# Altium schematic sheet [02] Power.SchDoc
size B; Organization: Altium Limited; Address1: L3, 12a Rodborough Rd; Address2: Frenchs Forest; Address3: NSW; Address4: Australia 2086
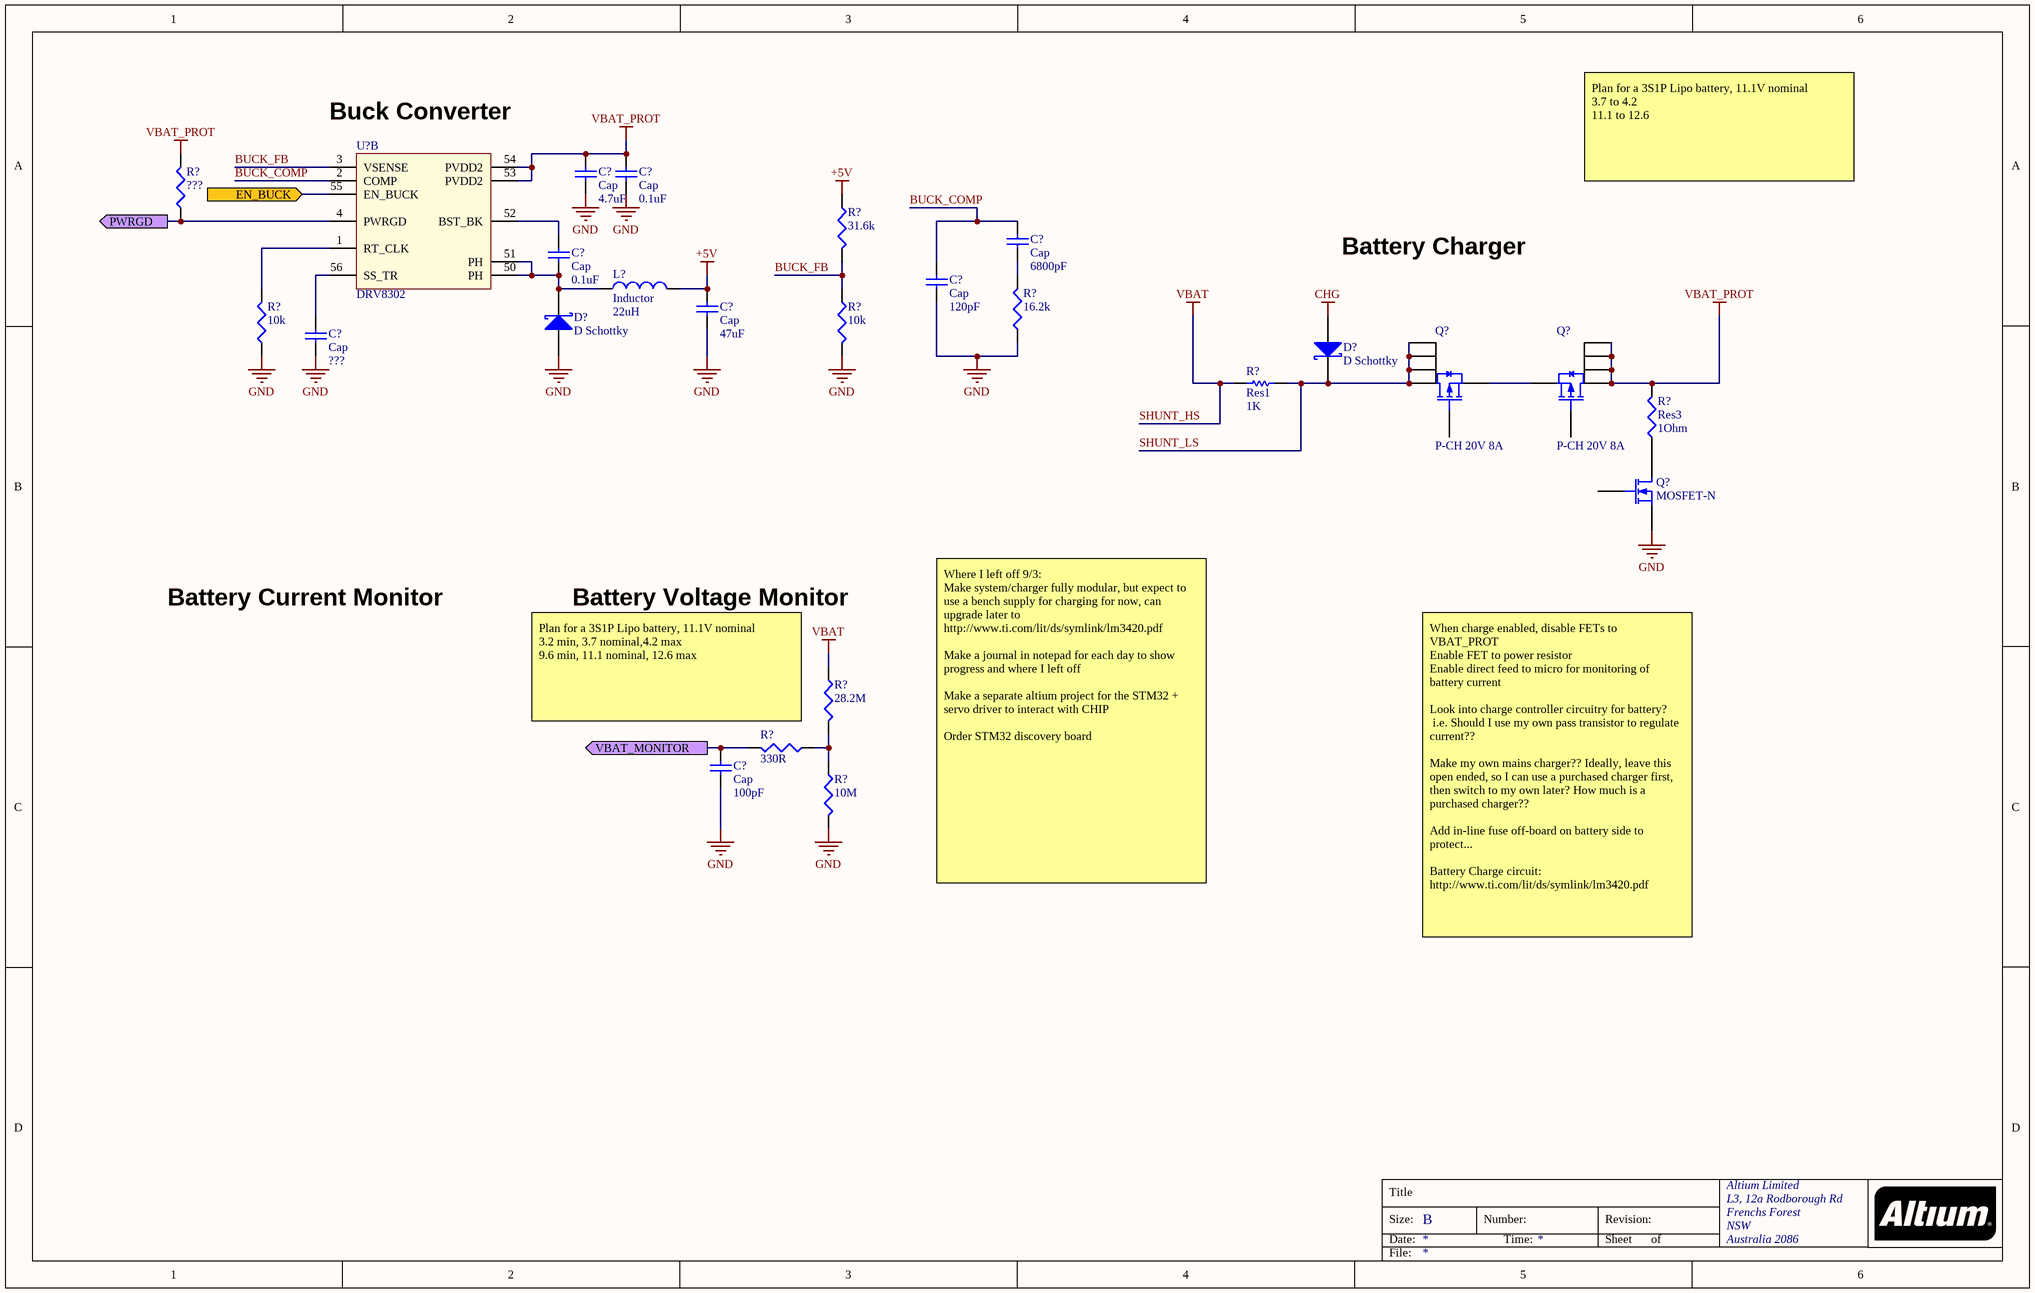
[diagram p0: [02] Power.SchDoc]

## Parts
(Parts that share a designator on the sheet are numbered #1, #2 ... from top to bottom, then left to right.)
C?#1  Cap  value 4.7uF  [RAD-0.3]
C?#2  Cap  value 0.1uF  [RAD-0.3]
C?#3  Cap  value 6800pF  [RAD-0.3]
C?#4  Cap  value 0.1uF  [RAD-0.3]
C?#5  Cap  value 120pF  [RAD-0.3]
C?#6  Cap  value 47uF  [RAD-0.3]
C?#7  Cap  value ???  [RAD-0.3]
C?#8  Cap  value 100pF  [RAD-0.3]
D?#1  D Schottky  [SMB]
D?#2  D Schottky  [SMB]
L?  Inductor  value 22uH  [AXIAL-0.8]
Q?#1  P-CH 20V 8A  [TSOP-6]
Q?#2  P-CH 20V 8A  [TSOP-6]
Q?#3  MOSFET-N  [E3]
R?#1  ???  [0603_CAP]
R?#2  31.6k  [0603_CAP]
R?#3  16.2k  [0603_CAP]
R?#4  10k  [0603_CAP]
R?#5  10k  [0603_CAP]
R?#6  Res1  value 1K  [AXIAL-0.3]
R?#7  Res3  value 1Ohm  [J1-0603]
R?#8  28.2M  [0603_CAP]
R?#9  330R  [0603_CAP]
R?#10  10M  [0603_CAP]
U?  DRV8302  (part B of 2)

## Ports
EN_BUCK (in), PWRGD (out), VBAT_MONITOR (out)

## Nets
+5V: C?#6.2 L?.2 R?#2.2
CHG: D?#2.1(A)
GND: C?#1.1 C?#2.1 C?#5.1 C?#6.1 C?#7.1 C?#8.1 D?#1.1(A) Q?#3.3(S) R?#3.1 R?#4.1 R?#5.1 R?#10.1
SHUNT_HS: R?#6.1 R?#8.2  [also labelled VBAT]
VBAT_PROT: C?#1.2 C?#2.2 Q?#2.1(D) Q?#2.2(D) Q?#2.5(D) Q?#2.6(D) R?#1.2 R?#7.2 U?.53(PVDD2) U?.54(PVDD2)
BUCK_COMP: C?#3.2 C?#5.2 U?.2(COMP)
BUCK_FB: R?#2.1 R?#5.2 U?.3(VSENSE)
EN_BUCK: U?.55(EN_BUCK) ; port EN_BUCK
PWRGD: R?#1.1 U?.4(PWRGD) ; port PWRGD
SHUNT_LS: D?#2.2(K) Q?#1.1(D) Q?#1.2(D) Q?#1.5(D) Q?#1.6(D) R?#6.2
VBAT_MONITOR: C?#8.2 R?#9.1 ; port VBAT_MONITOR
NetC?#3_1: C?#3.1 R?#3.2
NetC?#4_1: C?#4.1 D?#1.2(K) L?.1 U?.50(PH) U?.51(PH)
NetC?#4_2: C?#4.2 U?.52(BST_BK)
NetC?#7_2: C?#7.2 U?.56(SS_TR)
NetQ?#1_4: Q?#1.4(S) Q?#2.4(S)
NetQ?#3_1: Q?#3.1(D) R?#7.1
NetR?#4_2: R?#4.2 U?.1(RT_CLK)
NetR?#8_1: R?#8.1 R?#9.2 R?#10.2

Not connected (* = marked no-connect by the designer): Q?#1 3(G); Q?#2 3(G); Q?#3 2(G)

## Notes on the sheet
- (near U?) Buck Converter
- Plan for a 3S1P Lipo battery, 11.1V nominal
  3.7 to 4.2
  11.1 to 12.6
- Battery Charger
- Battery Current Monitor
- Battery Voltage Monitor
- (near R?#8) Plan for a 3S1P Lipo battery, 11.1V nominal
  3.2 min, 3.7 nominal,4.2 max
  9.6 min, 11.1 nominal, 12.6 max
- Where I left off 9/3:
  Make system/charger fully modular, but expect to use a bench supply for charging for now, can upgrade later to
  http://www.ti.com/lit/ds/symlink/lm3420.pdf
  Make a journal in notepad for each day to show progress and where I left off
  Make a separate altium project for the STM32 + servo driver to interact with CHIP
  Order STM32 discovery board
- When charge enabled, disable FETs to VBAT_PROT
  Enable FET to power resistor
  Enable direct feed to micro for monitoring of battery current
  Look into charge controller circuitry for battery?
  i.e. Should I use my own pass transistor to regulate current??
  Make my own mains charger?? Ideally, leave this open ended, so I can use a purchased charger first, then switch to my own later? How much is a purchased charger??
  Add in-line fuse off-board on battery side to protect...
  Battery Charge circuit:
  http://www.ti.com/lit/ds/symlink/lm3420.pdf
- Title
- Size:
- Date:
- B
- Number:
- Time:
- Revision:
- Sheet
- of
- File:

## Library data of the parts
C?#1-C?#8 = Cap: Capacitor; Published: 8-Jun-2000; LatestRevisionDate: 17-Jul-2002; LatestRevisionNote: Re-released for DXP Platform.; PackageReference: RAD-0.3; Publisher: Altium Limited; PackageDescription: Radial Cap, Thru-Hole; 2 Leads; 0.3 in Pin Spacing
D?#1 D?#2 = D Schottky: Schottky Diode; Published: 8-Jun-2000; LatestRevisionDate: 17-Jul-2002; LatestRevisionNote: Re-released for DXP Platform.; PackageReference: SMB; Publisher: Altium Limited; PackageDescription: DO-214-AA/SMB; 2 C-Bend Leads; Body 5.3 x 3.6 mm, inc. leads (LxW); Code_JEDEC: DO-214-AA
L? = Inductor: Code_IEC: 1005; Published: 8-Jun-2000; LatestRevisionDate: 29-May-2009; LatestRevisionNote: IPC-7351 Footprint Added.; PackageReference: 0402-A; Publisher: Altium Limited; PackageDescription: Chip Inductor; Code_JEITA: 0402
Q?#1 Q?#2 = SI3407DV-T1-GE3: MOSFET P-CH 20V 8A 6-TSOP; Manufacturer 1: Vishay Siliconix; Category 1: Discrete Semiconductor Products; FET Type: MOSFET P-Channel, Metal Oxide; FET Feature: Standard; Current - Continuous Drain (Id) @ 25°C: 8A (Tc); Rds On (Max) @ Id, Vgs: 24 mOhm @ 7.5A, 4.5V; Vgs(th) (Max) @ Id: 1.5V @ 250µA; Gate Charge (Qg) @ Vgs: 63nC @ 10V; Input Capacitance (Ciss) @ Vds: 1670pF @ 10V; Power - Max: 4.2W; Supplier 1: Digi-Key; Manufacturer Part Number 1: SI3407DV-T1-GE3; RoHS: RoHS Compliant; Description 1: MOSFET P-CH 20V 8A 6-TSOP; Stock 1: 6059; Pricing 1: 1=0.5, 10=0.425, 25=0.3964, 100=0.3172, 250=0.2946, 500=0.24926, 1000=0.19261 (USD); Packaging: Cut Tape (CT); Part Status: Active; Drain to Source Voltage (Vdss): 20V; Operating Temperature: -55°C ~ 150°C (TJ); Mounting Type: Surface Mount; Package / Case: SOT-23-6 Thin, TSOT-23-6; Supplier Device Package: 6-TSOP; ComponentLink1URL: http://www.vishay.com/docs/69987/si3407dv.pdf; ComponentLink1Description: http://www.vishay.com/docs/69987/si3407dv.pdf; Supplier Part Number 1: SI3407DV-T1-GE3CT-ND
Q?#3 = MOSFET-N: N-Channel MOSFET; Published: 8-Jun-2000; LatestRevisionDate: 17-Jul-2002; LatestRevisionNote: Re-released for DXP Platform.; PackageVersion: 1995/1996; PackageReference: E3; Publisher: Altium Limited; PackageDescription: TO, Flat Index; 3 In-Line, Axial Leads; Body Dia. 4.6mm; Lead Dia. 0.5 mm (max)
R?#1-R?#5 R?#8-R?#10 = RC0603FR-073K3L: RES SMD 3.3K OHM 1% 1/10W 0603; Manufacturer 1: Yageo; Category 1: Resistors; Power (Watts): 0.1W, 1/10W; Temperature Coefficient: ±100ppm/°C; Supplier 1: Digi-Key; Manufacturer Part Number 1: RC0603FR-073K3L; RoHS: RoHS Compliant; Description 1: RES SMD 3.3K OHM 1% 1/10W 0603; Stock 1: 668905; Pricing 1: 1=0.1, 10=0.014, 25=0.01, 100=0.0057, 250=0.00436, 500=0.00348, 1000=0.00257, 2500=0.00223 (USD); Packaging: Cut Tape (CT); Resistance (Ohms): 3.3k; Tolerance: ±1%; Composition: Thick Film; Features: Moisture Resistant; Operating Temperature: -55°C ~ 155°C; Package / Case: 0603 (1608 Metric); Supplier Device Package: 0603; Size / Dimension: 0.063" L x 0.031" W (1.60mm x 0.80mm); Height: 0.022" (0.55mm); Number of Terminations: 2; ComponentLink1URL: http://www.yageo.com/documents/recent/PYu-RC_Group_51_RoHS_L_04.pdf; ComponentLink1Description: http://www.yageo.com/documents/recent/PYu-RC_Group_51_RoHS_L_04.pdf; Supplier Part Number 1: 311-3.30KHRCT-ND
R?#6 = Res1: Resistor; Published: 8-Jun-2000; LatestRevisionDate: 17-Jul-2002; LatestRevisionNote: Re-released for DXP Platform.; PackageReference: AXIAL-0.3; Publisher: Altium Limited; PackageDescription: Axial Device, Thru-Hole; 2 Leads; 0.3 in Pin Spacing
R?#7 = Res3: Resistor; Published: 8-Jun-2000; LatestRevisionDate: 29-May-2009; LatestRevisionNote: IPC-7351 Footprint Added.; PackageReference: J1-0603; Publisher: Altium Limited; PackageDescription: Chip Resistor
U? = DRV8302DCAR: IC MOTOR CONTROLLER PAR 56HTSSOP; Manufacturer 1: Texas Instruments; Category 1: Integrated Circuits (ICs); Motor Type - AC, DC: Brushless DC (BLDC); Function: Controller - Commutation, Direction Management; Output Configuration: Pre-Driver - Half Bridge (3); Interface: Parallel; Voltage - Supply: 8 V ~ 60 V; Supplier 1: Digi-Key; Manufacturer Part Number 1: DRV8302DCAR; RoHS: RoHS Compliant; Description 1: IC MOTOR CONTROLLER PAR 56HTSSOP; Stock 1: 3089; Pricing 1: 1=6.14, 10=5.516, 100=4.5191, 500=3.84706, 1000=3.2445 (USD); Packaging: Cut Tape (CT); Part Status: Active; Motor Type - Stepper: -; Technology: Power MOSFET; Step Resolution: -; Applications: General Purpose; Current - Output: -; Voltage - Load: -; Operating Temperature: -40°C ~ 125°C (TA); Mounting Type: Surface Mount; Package / Case: 56-TFSOP (0.240", 6.10mm Width) Exposed Pad; Supplier Device Package: 56-HTSSOP; ComponentLink1URL: http://www.ti.com/lit/ds/symlink/drv8302.pdf; ComponentLink1Description: http://www.ti.com/lit/ds/symlink/drv8302.pdf; Supplier Part Number 1: 296-29544-1-ND